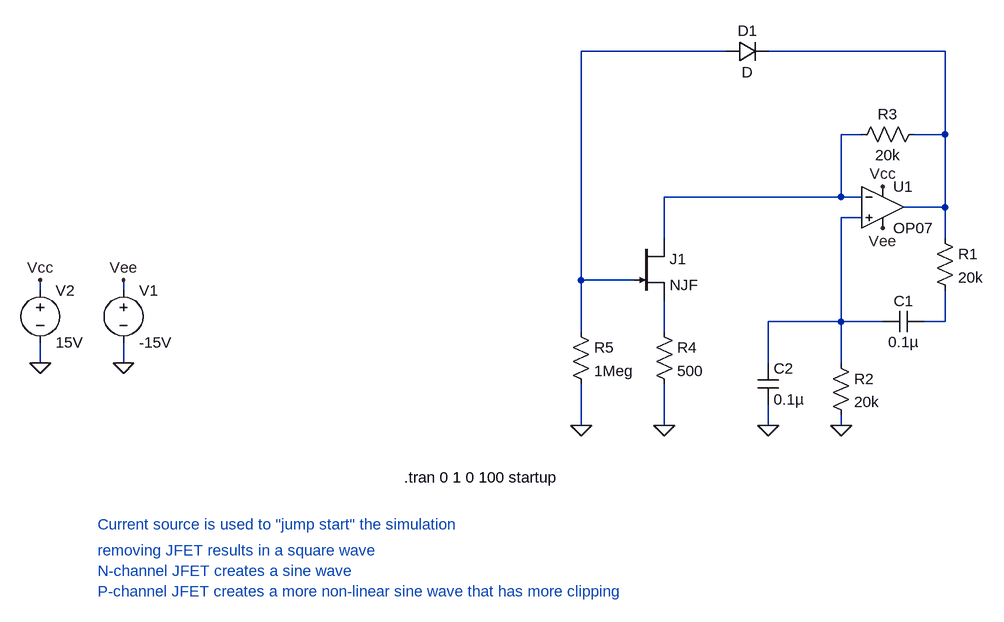
[diagram p0: schematic Oscillator demo.asc]
Oscillator demo.asc, the LTspice schematic file:
Version 4
SHEET 1 880 732
WIRE -32 -112 -256 -112
WIRE 304 -112 32 -112
WIRE 176 16 144 16
WIRE 304 16 304 -112
WIRE 304 16 256 16
WIRE 144 112 144 16
WIRE 144 112 -128 112
WIRE 176 112 144 112
WIRE 304 128 304 16
WIRE 304 128 240 128
WIRE 176 144 144 144
WIRE -128 176 -128 112
WIRE 304 176 304 128
WIRE -256 240 -256 -112
WIRE -176 240 -256 240
WIRE -1088 256 -1088 240
WIRE -960 256 -960 240
WIRE 144 304 144 144
WIRE 144 304 32 304
WIRE 208 304 144 304
WIRE 304 304 304 256
WIRE 304 304 272 304
WIRE -256 320 -256 240
WIRE -128 320 -128 272
WIRE -1088 368 -1088 336
WIRE -960 368 -960 336
WIRE 32 368 32 304
WIRE 144 368 144 304
WIRE -256 464 -256 400
WIRE -128 464 -128 400
WIRE 32 464 32 432
WIRE 144 464 144 448
FLAG 144 464 0
FLAG 32 464 0
FLAG -256 464 0
FLAG -128 464 0
FLAG -1088 368 0
FLAG -960 368 0
FLAG -1088 240 Vcc
FLAG -960 240 Vee
FLAG 208 96 Vcc
FLAG 208 160 Vee
SYMBOL OpAmps\\OP07 208 64 R0
SYMATTR InstName U1
SYMBOL res 288 160 R0
SYMATTR InstName R1
SYMATTR Value 20k
SYMBOL cap 272 288 R90
WINDOW 0 0 32 VBottom 2
WINDOW 3 32 32 VTop 2
SYMATTR InstName C1
SYMATTR Value 0.1µ
SYMBOL res 128 352 R0
SYMATTR InstName R2
SYMATTR Value 20k
SYMBOL cap 16 368 R0
SYMATTR InstName C2
SYMATTR Value 0.1µ
SYMBOL res 272 0 R90
WINDOW 0 0 56 VBottom 2
WINDOW 3 32 56 VTop 2
SYMATTR InstName R3
SYMATTR Value 20k
SYMBOL res -144 304 R0
SYMATTR InstName R4
SYMATTR Value 500
SYMBOL res -272 304 R0
SYMATTR InstName R5
SYMATTR Value 1Meg
SYMBOL voltage -960 240 R0
SYMATTR InstName V1
SYMATTR Value -15V
SYMBOL voltage -1088 240 R0
SYMATTR InstName V2
SYMATTR Value 15V
SYMBOL diode -32 -96 R270
WINDOW 0 32 32 VTop 2
WINDOW 3 0 32 VBottom 2
SYMATTR InstName D1
SYMBOL njf -176 176 R0
SYMATTR InstName J1
TEXT -528 544 Left 2 !.tran 0 1 0 100 startup
TEXT -1000 616 Left 2 ;Current source is used to "jump start" the simulation
TEXT -1000 656 Left 2 ;removing JFET results in a square wave
TEXT -1000 688 Left 2 ;N-channel JFET creates a sine wave\nP-channel JFET creates a more non-linear sine wave that has more clipping

The netlist it stands for:
* Oscillator demo.asc
XU1 N004 N003 Vcc Vee N002 LT1001  ; OP07, pins In+ In- V+ V- OUT
R1 N002 N005 20k
C1 N005 N004 0.1µ
R2 N004 0 20k
C2 N004 0 0.1µ
R3 N002 N003 20k
R4 N006 0 500
R5 N001 0 1Meg
V1 Vee 0 -15V
V2 Vcc 0 15V
D1 N001 N002 D
J1 N003 N001 N006 NJF
.model D D
.lib standard.dio
.model NJF NJF
.model PJF PJF
.lib standard.jft
.tran 0 1 0 100 startup
* Current source is used to "jump start" the simulation
* removing JFET results in a square wave
* N-channel JFET creates a sine wave
* P-channel JFET creates a more non-linear sine wave that has more clipping
.lib LTC.lib
.backanno
.end